# EAGLE design thedevice (EAGLE 7.2.0)

## Sheet 1 of 6: power supply
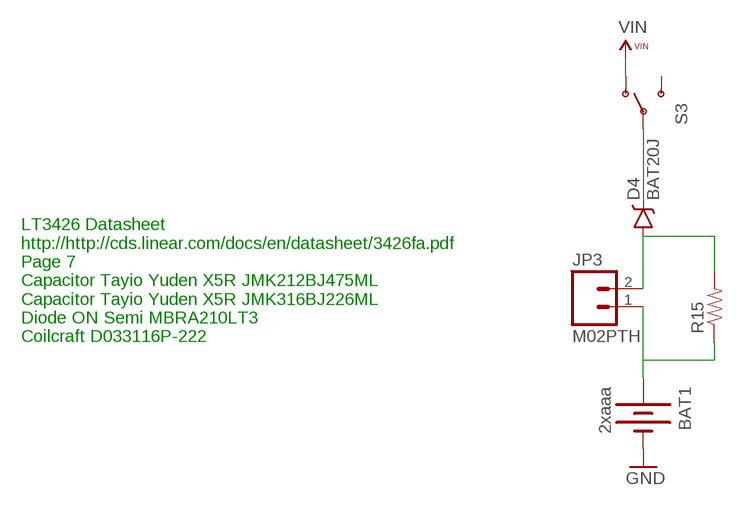
[diagram p0: schematic, sheet 1]

### Parts
BAT1  2xaaa  BATTERY  [BATTERY-2AAA-2468-PTH]
D4  BAT20J  DIODE-SCHOTTKY-BAT20J  [SOD-323]
JP3  M02PTH  [1X02]
R15  RESISTOR0603-RES  [0603-RES]
S3  SWITCH-SPDTSMD2  [SWITCH-SPDT-SMD]

### Nets
GND [power]: BAT1.- ; also sheet 2,3,4,5,6
N$3 [power]: BAT1.+ JP3.1 R15.1
N$11 [power]: D4.C S3.2(P)
N$12 [power]: D4.A JP3.2 R15.2
VIN [power]: S3.1(O) ; also sheet 3,5,6
Unconnected: S3.3(S)

### Notes on the sheet
- LT3426 Datasheet
  http://http://cds.linear.com/docs/en/datasheet/3426fa.pdf
  Page 7
  Capacitor Tayio Yuden X5R JMK212BJ475ML
  Capacitor Tayio Yuden X5R JMK316BJ226ML
  Diode ON Semi MBRA210LT3
  Coilcraft D033116P-222

## Sheet 2 of 6: Sensors
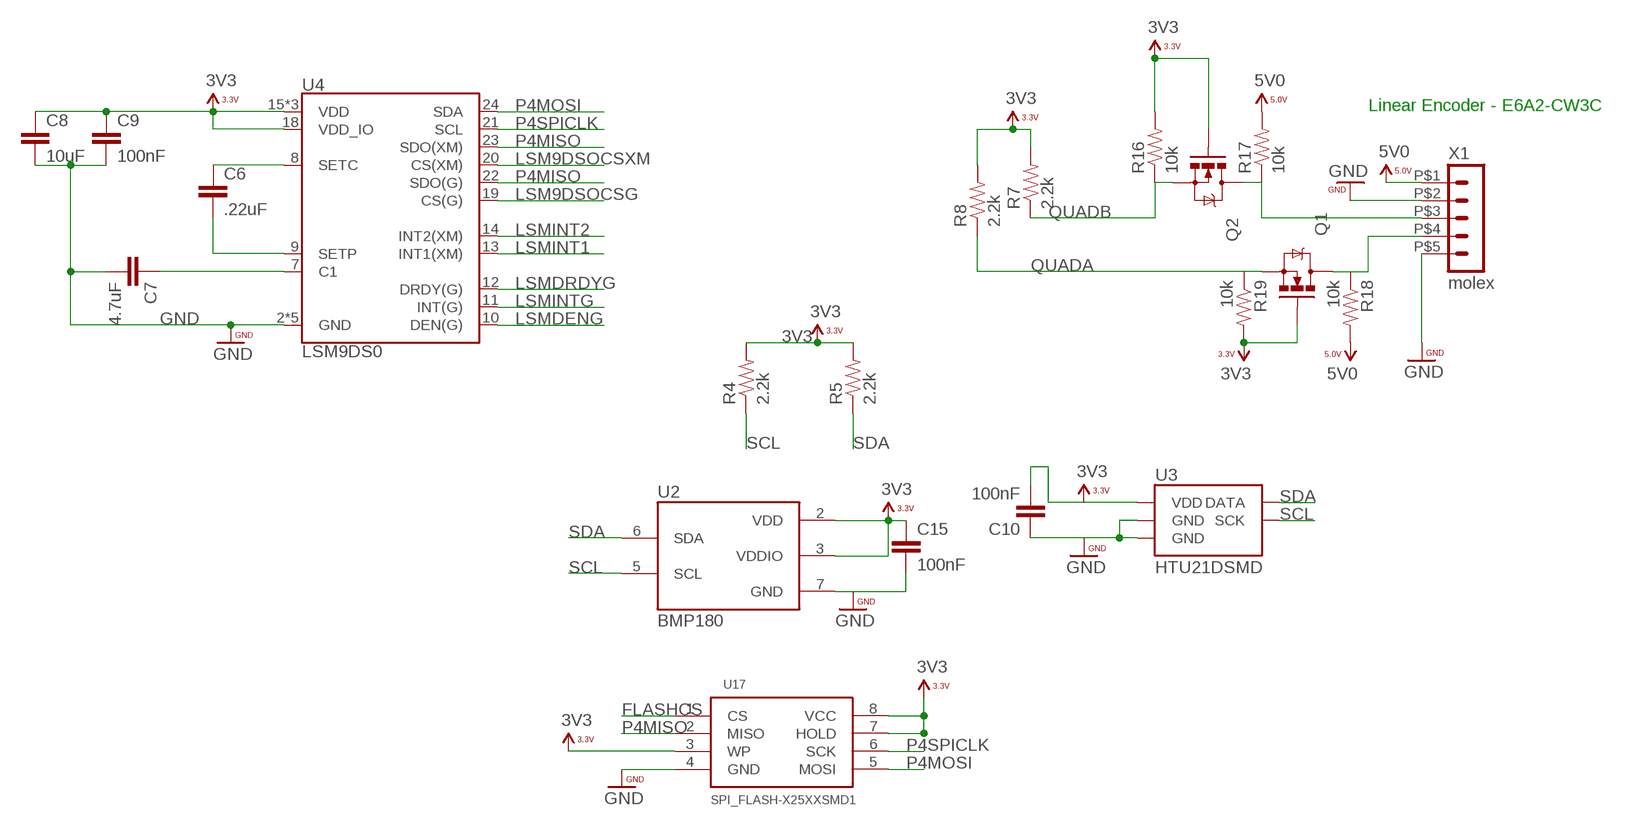
[diagram p1: schematic, sheet 2]

### Parts
C6  .22uF  CAP0603-CAP  [0603-CAP]
C7  4.7uF  CAP0603-CAP  [0603-CAP]
C8  10uF  CAP0603-CAP  [0603-CAP]
C9  100nF  CAP0603-CAP  [0603-CAP]
C10  100nF  CAP0603-CAP  [0603-CAP]
C15  100nF  CAP0603-CAP  [0603-CAP]
Q1  MOSFET-NCHANNEL2N7002PW  [SOT323]
Q2  MOSFET-NCHANNEL2N7002PW  [SOT323]
R4  2.2k  RESISTOR0603  [0603-RES]
R5  2.2k  RESISTOR0603  [0603-RES]
R7  2.2k  RESISTOR0603  [0603-RES]
R8  2.2k  RESISTOR0603  [0603-RES]
R16  10k  RESISTOR0603  [0603-RES]
R17  10k  RESISTOR0603  [0603-RES]
R18  10k  RESISTOR0603  [0603-RES]
R19  10k  RESISTOR0603  [0603-RES]
U2  BMP180  [BMP180]
U3  HTU21DSMD  [HTU21D]
U4  LSM9DS0  [LGA-24]
U17  SPI_FLASH-X25XXSMD1  [SO08-EIAJ]
X1  molex  HEADER_POS5_43650-0500  [43650-0500]

### Nets
3V3 [power]: C8.1 C9.1 C10.2 C15.1 Q1.1(G) Q2.1(G) R4.2 R5.2 R7.2 R8.2 R16.2 R19.2 U2.2(VDD) U2.3(VDDIO) U3.VDD U4.15(VDD) U4.16(VDD) U4.17(VDD) U4.18(VDD_IO) U17.3(WP) U17.7(HOLD) U17.8(VCC) ; also sheet 3,4,6
5V0 [power]: R17.2 R18.2 X1.P$1 ; also sheet 4,5
FLASHCS: U17.1(CS) ; also sheet 3
GND [power]: C7.2 C8.2 C9.2 C10.1 C15.2 U2.7(GND) U3.7(GND) U3.GND U4.2(GND) U4.3(GND) U4.4(GND) U4.5(GND) U4.6(GND) U17.4(GND) X1.P$2 X1.P$5 ; also sheet 1,3,4,5,6
LSM9DSOCSG: U4.19(CS(G)) ; also sheet 3
LSM9DSOCSXM: U4.20(CS(XM)) ; also sheet 3
LSMDENG: U4.10(DEN(G)) ; also sheet 3
LSMDRDYG: U4.12(DRDY(G)) ; also sheet 3
LSMINT1: U4.13(INT1(XM)) ; also sheet 3
LSMINT2: U4.14(INT2(XM)) ; also sheet 3
LSMINTG: U4.11(INT(G)) ; also sheet 3
N$4: C6.2 U4.9(SETP)
N$5: C7.1 U4.7(C1)
N$6: C6.1 U4.8(SETC)
N$14: Q2.3(D) R17.1 X1.P$3
N$19: Q1.3(D) R18.1 X1.P$4
P4MISO: U4.22(SDO(G)) U4.23(SDO(XM)) U17.2(MISO) ; also sheet 3
P4MOSI: U4.24(SDA) U17.5(MOSI) ; also sheet 3
P4SPICLK: U4.21(SCL) U17.6(SCK) ; also sheet 3
QUADA: Q1.2(S) R8.1 R19.1 ; also sheet 3
QUADB: Q2.2(S) R7.1 R16.1 ; also sheet 3
SCL: R4.1 U2.5(SCL) U3.SCK ; also sheet 3,4
SDA: R5.1 U2.6(SDA) U3.DATA ; also sheet 3,4

### Notes on the sheet
- Linear Encoder - E6A2-CW3C

## Sheet 3 of 6: BLE
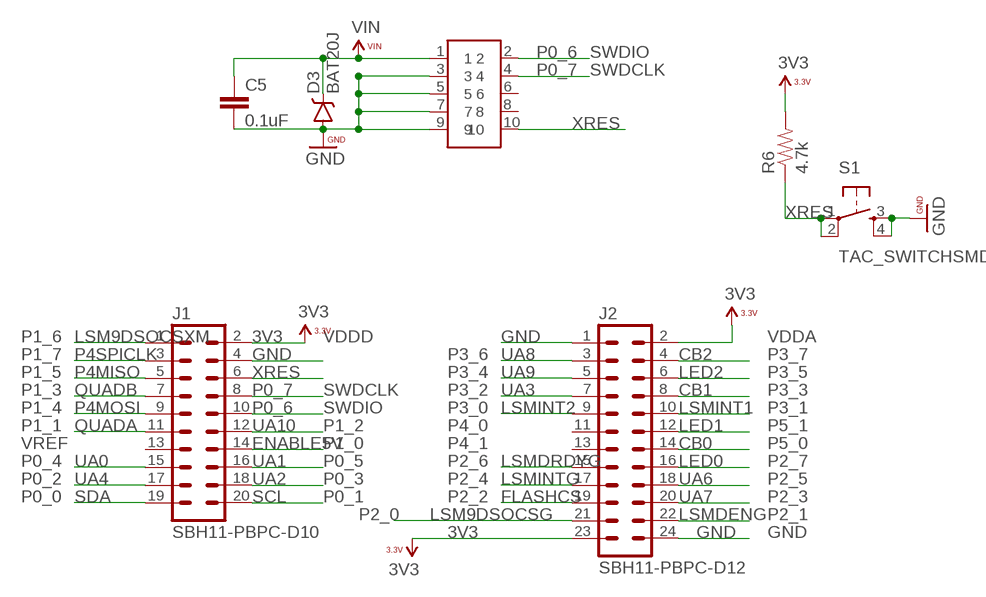
[diagram p2: schematic, sheet 3]

### Parts
C5  0.1uF  CAP0603-CAP  [0603-CAP]
D3  BAT20J  DIODE-SCHOTTKY-BAT20J  [SOD-323]
J1  SBH11-PBPC-D10  [SBH11-PBPC-D10]
J2  SBH11-PBPC-D12  [SBH11-PBPC-D12]
JP  SAMTEC  [FTSH-105-01-XXX-DV-K]
R6  4.7k  RESISTOR0603-RES  [0603-RES]
S1  TAC_SWITCHSMD  [TACTILE-SWITCH-SMD]

### Nets
3V3 [power]: J1.2 J2.2 J2.23 R6.2 ; also sheet 2,4,6
CB0: J2.14 ; also sheet 4
CB1: J2.8 ; also sheet 4
CB2: J2.4 ; also sheet 4
ENABLE5V: J1.14 ; also sheet 5
FLASHCS: J2.19 ; also sheet 2
GND [power]: C5.2 D3.A J1.4 J2.1 J2.24 JP.3 JP.5 JP.7 JP.9 S1.3 S1.4 ; also sheet 1,2,4,5,6
LED0: J2.16 ; also sheet 4
LED1: J2.12 ; also sheet 4
LED2: J2.6 ; also sheet 4
LSM9DSOCSG: J2.21 ; also sheet 2
LSM9DSOCSXM: J1.1 ; also sheet 2
LSMDENG: J2.22 ; also sheet 2
LSMDRDYG: J2.15 ; also sheet 2
LSMINT1: J2.10 ; also sheet 2
LSMINT2: J2.9 ; also sheet 2
LSMINTG: J2.17 ; also sheet 2
P0_6: J1.10 JP.2
P0_7: J1.8 JP.4
P4MISO: J1.5 ; also sheet 2
P4MOSI: J1.9 ; also sheet 2
P4SPICLK: J1.3 ; also sheet 2
QUADA: J1.11 ; also sheet 2
QUADB: J1.7 ; also sheet 2
SCL: J1.20 ; also sheet 2,4
SDA: J1.19 ; also sheet 2,4
UA0: J1.15 ; also sheet 4
UA1: J1.16 ; also sheet 4
UA2: J1.18 ; also sheet 4
UA3: J2.7 ; also sheet 4
UA4: J1.17 ; also sheet 4
UA6: J2.18 ; also sheet 4
UA7: J2.20 ; also sheet 4
UA8: J2.3 ; also sheet 4
UA9: J2.5 ; also sheet 4
UA10: J1.12 ; also sheet 4
VIN [power]: C5.1 D3.C JP.1 ; also sheet 1,5,6
XRES: J1.6 JP.10 R6.1 S1.1 S1.2
Unconnected: J1.13 J2.11 J2.13 JP.6 JP.8

### Notes on the sheet
- SWDIO
- SWDCLK
- P1_6 | VDDD | VDDA
- P1_7 | P3_6 | P3_7
- P1_5 | P3_4 | P3_5
- P1_3 | SWDCLK | P3_2 | P3_3
- P1_4 | SWDIO | P3_0 | P3_1
- P1_1 | P1_2 | P4_0 | P5_1
- VREF | P1_0 | P4_1 | P5_0
- P0_4 | P0_5 | P2_6 | P2_7
- P0_2 | P0_3 | P2_4 | P2_5
- P0_0 | P0_1 | P2_2 | P2_3
- P2_0 | P2_1
- GND

## Sheet 4 of 6: GUI
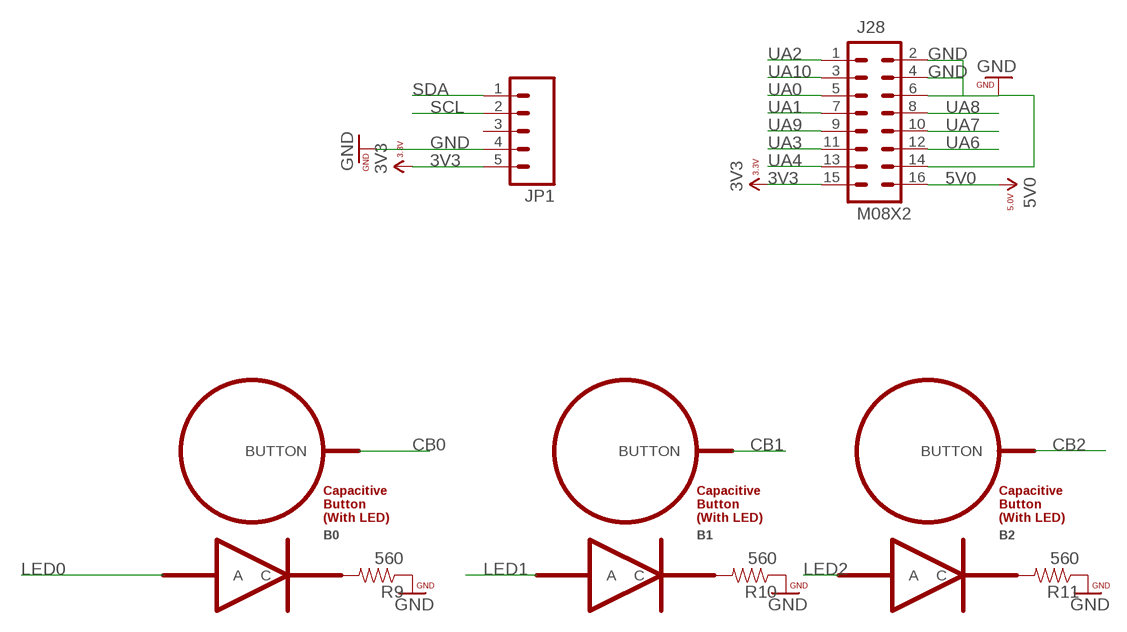
[diagram p3: schematic, sheet 4]

### Parts
B0  BUTTON_PASSIVE_LED  [BUTTON_PASSIVE_12MM_LED]
B1  BUTTON_PASSIVE_LED  [BUTTON_PASSIVE_12MM_LED]
B2  BUTTON_PASSIVE_LED  [BUTTON_PASSIVE_12MM_LED]
J28  M08X2  [2X8]
JP1  M05NO_SILK  [1X05_NO_SILK]
R9  560  RESISTOR0603-RES  [0603-RES]
R10  560  RESISTOR0603-RES  [0603-RES]
R11  560  RESISTOR0603-RES  [0603-RES]

### Nets
3V3 [power]: J28.15 JP1.5 ; also sheet 2,3,6
5V0 [power]: J28.16 ; also sheet 2,5
CB0: B0.BUTTON ; also sheet 3
CB1: B1.BUTTON ; also sheet 3
CB2: B2.BUTTON ; also sheet 3
GND [power]: J28.2 J28.4 J28.6 J28.14 JP1.4 R9.1 R10.1 R11.1 ; also sheet 1,2,3,5,6
LED0: B0.A ; also sheet 3
LED1: B1.A ; also sheet 3
LED2: B2.A ; also sheet 3
N$8: B0.C R9.2
N$9: B1.C R10.2
N$10: B2.C R11.2
SCL: JP1.2 ; also sheet 2,3
SDA: JP1.1 ; also sheet 2,3
UA0: J28.5 ; also sheet 3
UA1: J28.7 ; also sheet 3
UA2: J28.1 ; also sheet 3
UA3: J28.11 ; also sheet 3
UA4: J28.13 ; also sheet 3
UA6: J28.12 ; also sheet 3
UA7: J28.10 ; also sheet 3
UA8: J28.8 ; also sheet 3
UA9: J28.9 ; also sheet 3
UA10: J28.3 ; also sheet 3
Unconnected: JP1.3

## Sheet 5 of 6: 5.0V Power
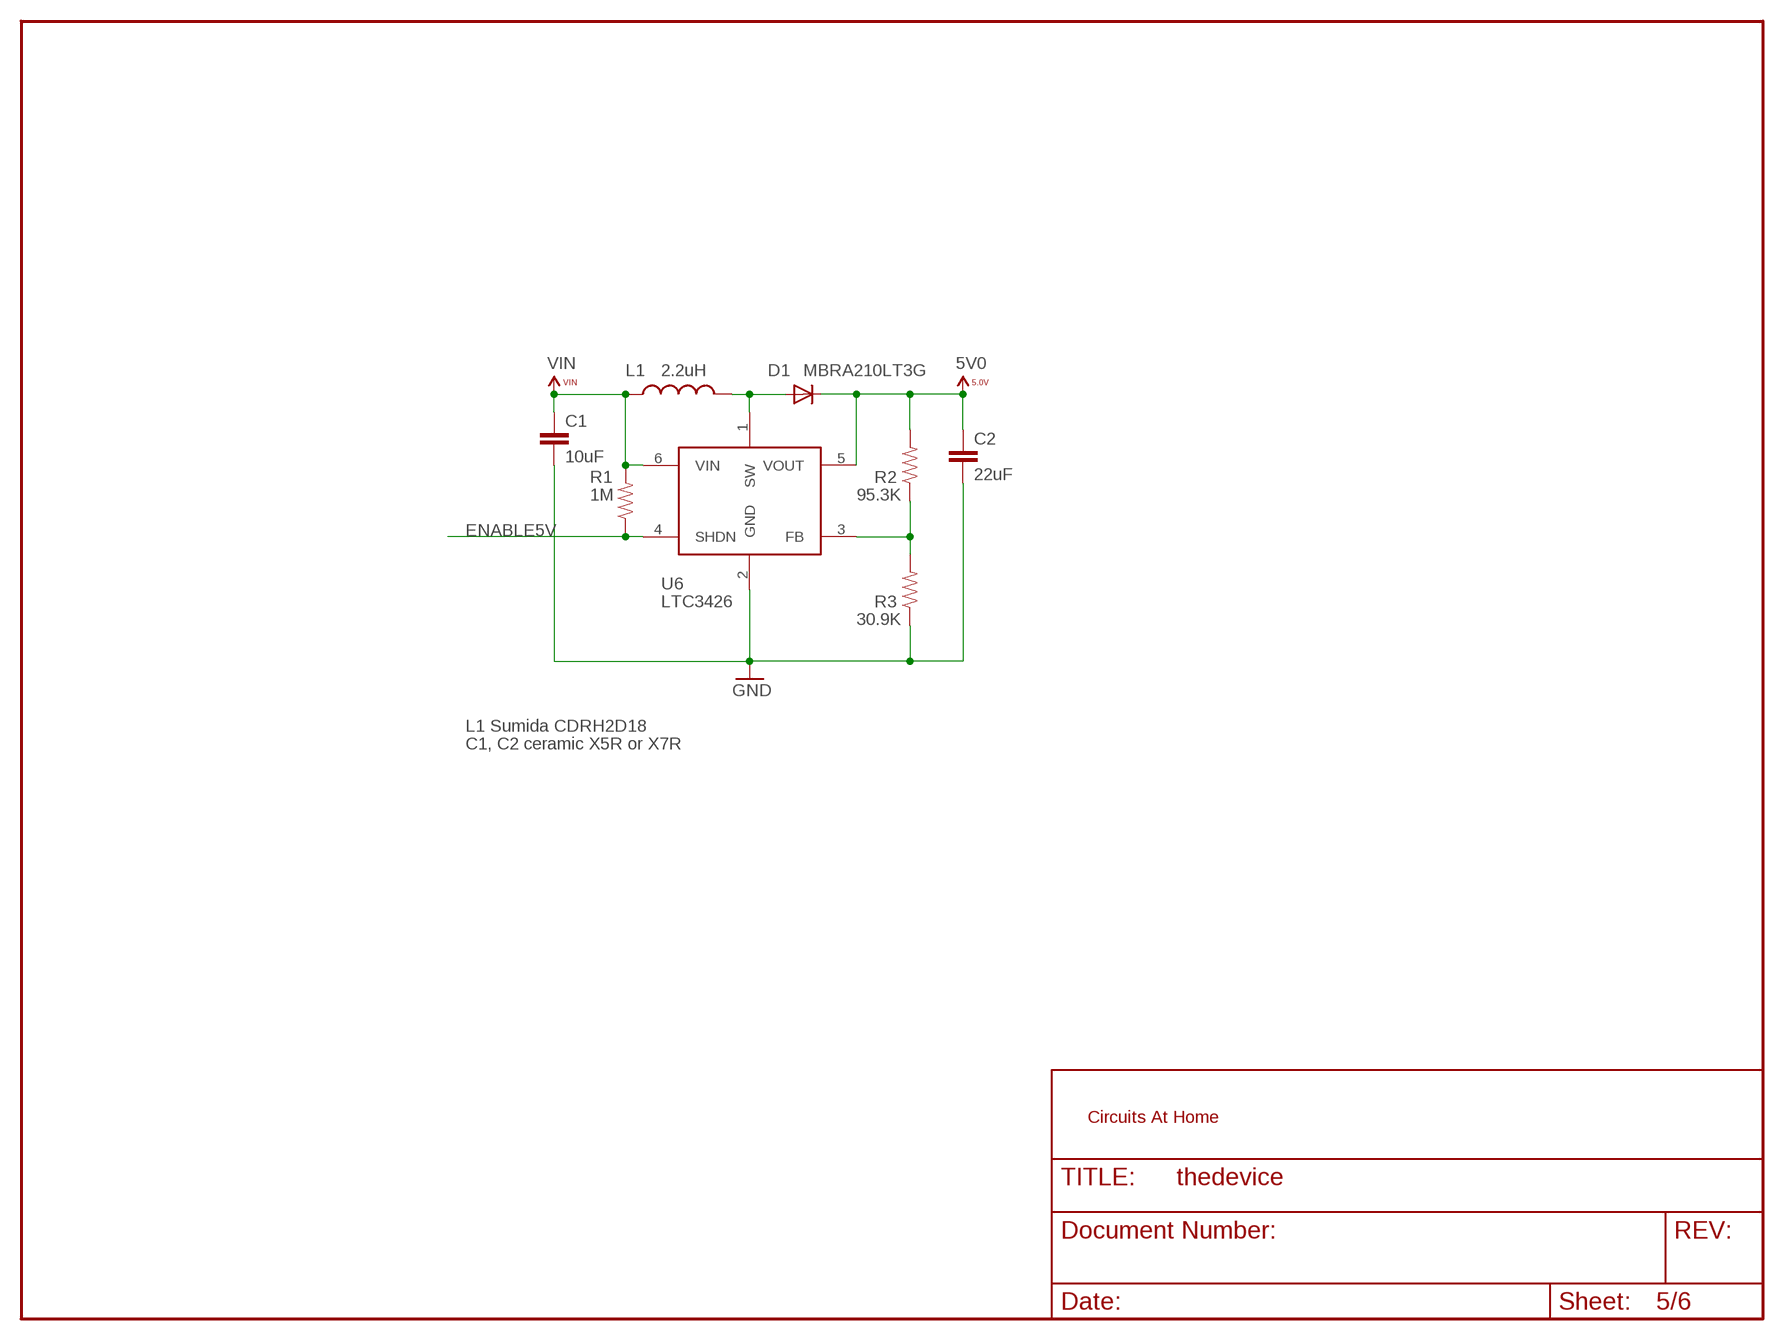
[diagram p4: schematic, sheet 5]

### Parts
C1  10uF  CAP0603-CAP  [0603-CAP]
C2  22uF  CAP0603-CAP  [0603-CAP]
D1  MBRA210LT3G  DIODESMA  [SMA-DIODE]
L1  2.2uH  INDUCTOR1313  [1_3X1_3]
R1  1M  RESISTOR0603  [0603]
R2  95.3K  RESISTOR0603  [0603]
R3  30.9K  RESISTOR0603  [0603]
U6  LTC3426  [SOT23-6]

### Nets
5V0 [power]: C2.1 D1.C R2.2 U6.5(VOUT) ; also sheet 2,4
ENABLE5V: R1.1 U6.4(SHDN) ; also sheet 3
FB5: R2.1 R3.2 U6.3(FB)
GND [power]: C1.2 C2.2 R3.1 U6.2(GND) ; also sheet 1,2,3,4,6
SW5: D1.A L1.P$2 U6.1(SW)
VIN [power]: C1.1 L1.P$1 R1.2 U6.6(VIN) ; also sheet 1,3,6

### Notes on the sheet
- L1 Sumida CDRH2D18
- C1, C2 ceramic X5R or X7R

## Sheet 6 of 6: 3.3V Power
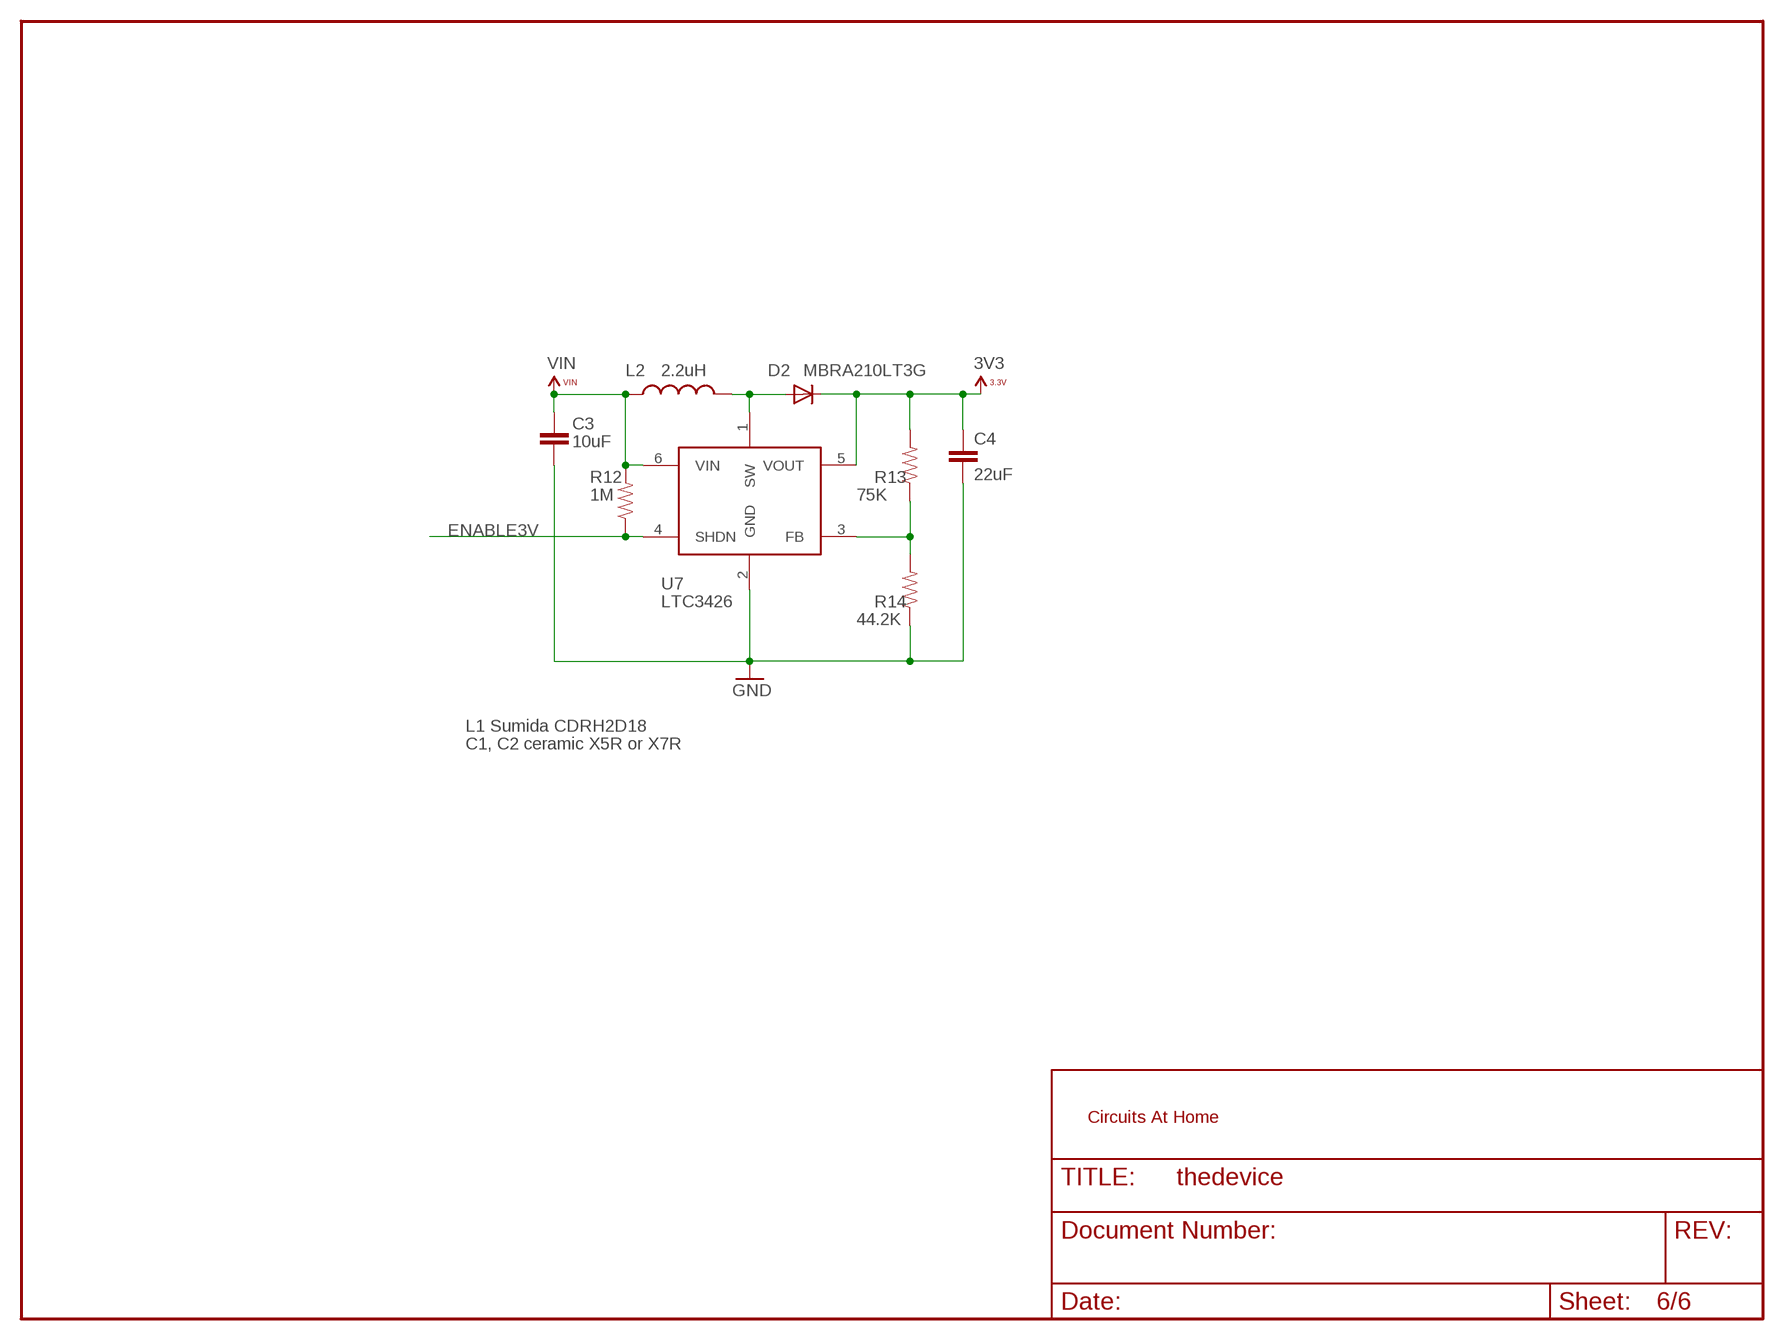
[diagram p5: schematic, sheet 6]

### Parts
C3  10uF  CAP0603  [0603]
C4  22uF  CAP0603-CAP  [0603-CAP]
D2  MBRA210LT3G  DIODESMA  [SMA-DIODE]
L2  2.2uH  INDUCTOR1313  [1_3X1_3]
R12  1M  RESISTOR0603  [0603]
R13  75K  RESISTOR0603  [0603]
R14  44.2K  RESISTOR0603  [0603]
U7  LTC3426  [SOT23-6]

### Nets
3V3 [power]: C4.1 D2.C R13.2 U7.5(VOUT) ; also sheet 2,3,4
ENABLE3V: R12.1 U7.4(SHDN)
FB3: R13.1 R14.2 U7.3(FB)
GND [power]: C3.2 C4.2 R14.1 U7.2(GND) ; also sheet 1,2,3,4,5
SW3: D2.A L2.P$2 U7.1(SW)
VIN [power]: C3.1 L2.P$1 R12.2 U7.6(VIN) ; also sheet 1,3,5

### Notes on the sheet
- L1 Sumida CDRH2D18
- C1, C2 ceramic X5R or X7R

## Library data of the parts
B0 B1 B2 = PatternAgents-TouchWidgets:BUTTON_PASSIVE_LED: Button, Passive Touch/Capacitive Sensing Type, with LED & Hole Source : http://www.PatternAgents.com Github : https://github.com/PatternAgents License : http://creativecommons.org/licenses/by-sa/3.1/ (Creative Commons 3.1) THIS SOFTWARE IS PROVIDED BY THE CONTRIBUTORS "AS IS" AND WITHOUT ANY EXPRESS OR IMPLIED WARRANTIES, INCLUDING, BUT NOT LIMITED TO, THE IMPLIED WARRANTIES OF MERCHANTABILITY AND FITNESS FOR A PARTICULAR PURPOSE ARE DISCLAIMED. IN NO EVENT SHALL THE COPYRIGHT OWNER OR CONTRIBUTORS BE LIABLE FOR ANY DIRECT, INDIRECT, INCIDENTAL, SPECIAL, EXEMPLARY, OR CONSEQUENTIAL DAMAGES (INCLUDING, BUT NOT LIMITED TO, PROCUREMENT OF SUBSTITUTE GOODS OR SERVICES; LOSS OF USE, DATA, OR PROFITS; OR BUSINESS INTERRUPTION) HOWEVER CAUSED AND ON ANY THEORY OF LIABILITY, WHETHER IN CONTRACT, STRICT LIABILITY, OR TORT (INCLUDING NEGLIGENCE OR OTHERWISE) ARISING IN ANY WAY OUT OF THE USE OF THIS SOFTWARE, EVEN IF ADVISED OF THE POSSIBILITY OF SUCH DAMAGE.; PARTNO: SML-LX1206IC-TR
BAT1 = SparkFun-Electromechanical:BATTERY: Battery Holders Various common sizes : AA, AAA, 20mm coin cell and 12mm coin cell. 20MM_4LEGS, BATT-10373; PARTNO: 2468
C1 C8 = SparkFun-Capacitors:CAP: Capacitor Standard 0603 ceramic capacitor, and 0.1" leaded capacitor.; PARTNO: GRM188R60J106ME47D
C2 C4 = SparkFun-Capacitors:CAP: Capacitor Standard 0603 ceramic capacitor, and 0.1" leaded capacitor.; PARTNO: GRM188R60G226MEA0D
C3 = CH_passive:CAP: Capacitor Standard 0603 ceramic capacitor, and 0.1" leaded capacitor.; PARTNO: GRM188R60J106ME47D
C5 C9 C10 C15 = SparkFun-Capacitors:CAP: Capacitor Standard 0603 ceramic capacitor, and 0.1" leaded capacitor.; PARTNO: GRM188R61E104KA01D
C6 = SparkFun-Capacitors:CAP: Capacitor Standard 0603 ceramic capacitor, and 0.1" leaded capacitor.; PARTNO: GRM188R61A224KA01D
C7 = SparkFun-Capacitors:CAP: Capacitor Standard 0603 ceramic capacitor, and 0.1" leaded capacitor.; PARTNO: GRM188R60J475KE19D
D1 D2 = CH_semiconductors:DIODE: Diode These are standard reverse protection diodes and small signal diodes. SMA package can handle up to about 1A. SOD-323 can handle about 200mA. What the SOD-323 package when ordering, there are some mfgs out there that are 5-pin packages.; PARTNO: MBRA210LT3G
D3 D4 = SparkFun-DiscreteSemi:DIODE-SCHOTTKY: Schottky diodes in SFE's production catalog BAT20J 1A 23V 0.62Vf RB751 120mA 40V 0.37Vf PMEG4005EJ 0.5A 40V 0.42Vf MBRA140 1A 40V 0.5Vf B340A 3A 40V SMA; PARTNO: NSR0320MW2T1G; PROD_ID: DIO-11623
J1 = con-sullins:SBH11-PBPC-D10: HEADER - Vertical, Shrouded; PARTNO: SBH11-PBPC-D10-ST-BK
J2 = con-sullins:SBH11-PBPC-D12: HEADER - Vertical, Shrouded; PARTNO: SBH11-PBPC-D12-RA-BK
J28 = SparkFun-Connectors:M08X2: .1" headers, two rows of 8 each
JP = arh:SAMTEC; PARTNO: FTSH-105-01-F-DV-K
JP1 = SparkFun-Connectors:M05: Header 5 Standard 5-pin 0.1" header. Use with straight break away headers (SKU : PRT-00116), right angle break away headers (PRT-00553), swiss pins (PRT-00743), machine pins (PRT-00117), and female headers (PRT-00115). Molex polarized connector foot print use with SKU : PRT-08230 with associated crimp pins and housings.
JP3 = SparkFun-Connectors:M02: Standard 2-pin 0.1" header. Use with - straight break away headers ( PRT-00116) - right angle break away headers (PRT-00553) - swiss pins (PRT-00743) - machine pins (PRT-00117) - female headers (PRT-00115) Molex polarized connector foot print use with: PRT-08233 with associated crimp pins and housings. 2.54_SCREWTERM for use with PRT-10571. 3.5mm Screw Terminal footprints for PRT-08084 5mm Screw Terminal footprints for use with PRT-08432
L1 L2 = CH_passive:INDUCTOR: Inductors Basic Inductor/Choke - 0603 and 1206. Footprints are not proven and vary greatly between part numbers.; PARTNO: CDRH2D09NP-2R2MC
Q1 Q2 = SparkFun-DiscreteSemi:MOSFET-NCHANNEL: Common NMOSFET Parts MFG P/N Store ID Prod ID FDD8780 TRANS-09984 SI7820DN TRANS-11055 FDS6630A IC-08089 2N7002PW TRANS-11151 FQP30N06L COM-10213 TRANS-10060 BSS123LT1G TRANS-08345 BSS138 TRANS-00830 BS170 2N7000; PROD_ID: TRANS-11151
R1 R12 = CH_passive:RESISTOR: Resistor; PARTNO: ERJ-3GEYJ105V
R2 = CH_passive:RESISTOR: Resistor; PARTNO: ERJ-3EKF9532V
R3 = CH_passive:RESISTOR: Resistor; PARTNO: ERJ-3EKF3092V
R4 R5 R7 R8 R16-R19 = SparkFun-Resistors:RESISTOR: Resistor; PARTNO: MCR03ERTJ222
R6 = SparkFun-Passives:RESISTOR: Resistor; PARTNO: ERJ-3GEYJ472V
R9-R11 = SparkFun-Passives:RESISTOR: Resistor; PARTNO: ERJ-3GEYJ561V
R13 = CH_passive:RESISTOR: Resistor; PARTNO: ERJ-3EKF7502V
R14 = CH_passive:RESISTOR: Resistor; PARTNO: ERJ-3EKF4422V
R15 = SparkFun-Passives:RESISTOR: Resistor
S1 = SparkFun-Electromechanical:TAC_SWITCH: Momentary Switch Button commonly used for reset or general input. Spark Fun Electronics SKU : COM-00097 SMT- SWCH-08247; PARTNO: PTS525SM10SMTR LFS; PROD_ID: SWCH-08247
S3 = SparkFun-Electromechanical:SWITCH-SPDT: SPDT Switch Simple slide switch, Spark Fun Electronics SKU : COM-00102 DPDT SMT slide switch, AYZ0202, SWCH-08179
U2 = SparkFun-Sensors:BMP180: BOSCH BMP180 DIGITAL BAROMETRIC PRESSURE SENSOR Web page: http://www.bosch-sensortec.com/en/homepage/products_3/environmental_sensors_1/bmp180_1/bmp180 Datasheet: http://ae-bst.resource.bosch.com/media/products/dokumente/bmp180/BST-BMP180-DS000-09.pdf The BMP180 is the function compatible successor of the BMP085, a new generation of high precision digital pressure sensors for consumer applications. The ultra-low power, low voltage electronics of the BMP180 is optimized for use in mobile phones, PDAs, GPS navigation devices and outdoor equipment. With a low altitude noise of merely 0.25m at fast conversion time, the BMP180 offers superior performance. The I2C interface allows for easy system integration with a microcontroller. The BMP180 is based on piezo-resistive technology for EMC robustness, high accuracy and linearity as well as long term stability. Key features: - Temperature measurement included - I2C interface - Fully calibrated - Pb-free, halogen-free and RoHS compliant, - MSL 1 Basic specs: Pressure range: 300 to 1100hPa (+9000m to -500m relating to sea level) Supply voltage: 1.8 to 3.6V (VDD), 1.62V to 3.6V (VDDIO) Package: LGA package with metal lid Small footprint: 3.6mm x 3.8mm Super-flat: 0.93mm height Low power: 5μA at 1 sample / sec. in standard mode Low noise: 0.06hPa (0.5m) in ultra low power mode, 0.02hPa (0.17m) advanced resolution mode Typical applications: - Enhancement of GPS navigation (dead-reckoning, slope detection, etc.) - In- and out-door navigation - Leisure and sports - Weather forecast - Vertical velocity indication (rise/sink speed); PARTNO: BMP180
U3 = SparkFun-Sensors:HTU21D
U4 = SparkFun-DigitalIC:LSM9DS0: LSM9DS0 3D Accelerometer, 3D Gyroscope, 3D Magnetomter Features: 3 acceleration channels, 3 angular rate channels, 3 magnetic field channels ±2/±4/±6/±8/±16 g linear acceleration full scale ±2/±4/±8/±12 gauss magnetic full scale ±245/±500/±2000 dps angular rate full scale 16-bit data output SPI / I2C serial interfaces Analog supply voltage 2.4 V to 3.6 V Power-down mode / low-power mode Programmable interrupt generators Embedded self-test Embedded temperature sensor Embedded FIFO Position and motion detection functions Click/double-click recognition
U6 U7 = CH_Linear_technology:LTC3426; PARTNO: LTC3426ES6#TRMPBF
U17 = SparkFun-DigitalIC:SPI_FLASH-X25XX: 8pin SPI Flash series x25xx. Works with devices like W25X32 and BR25L32
X1 = con-molex-micro-fit-3_0:HEADER_POS5_?: Molex - Micro-Fit 3.0 Series connector, 3.00mm (0.118") pitch header, 5 positions.; PARTNO: 0436500500

## Net classes
0 default: width 0.203 mm, clearance 0.205 mm
1 power: width 1.016 mm, clearance 0.205 mm to class 0, clearance 0.205 mm

## Board
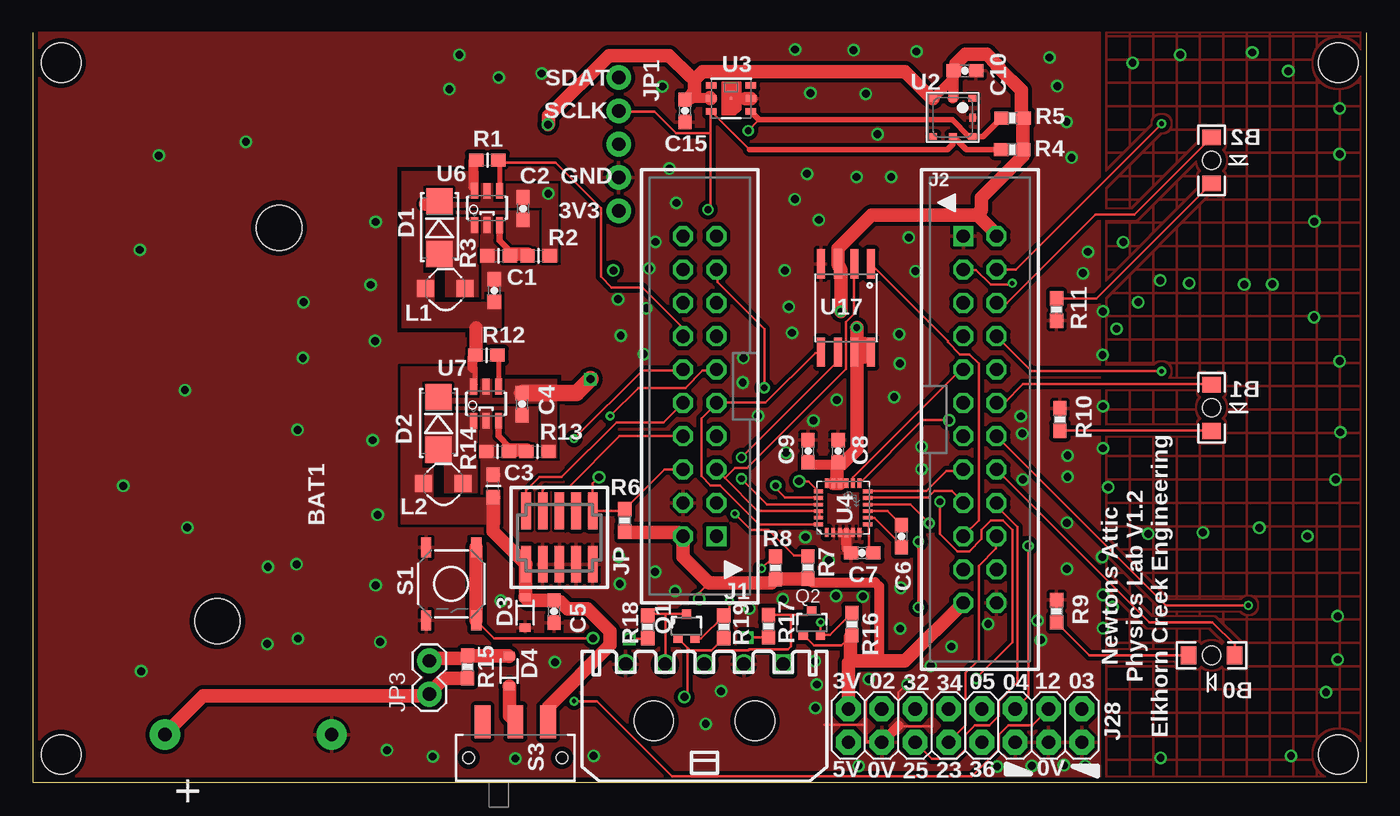
[diagram p6: board, top side]
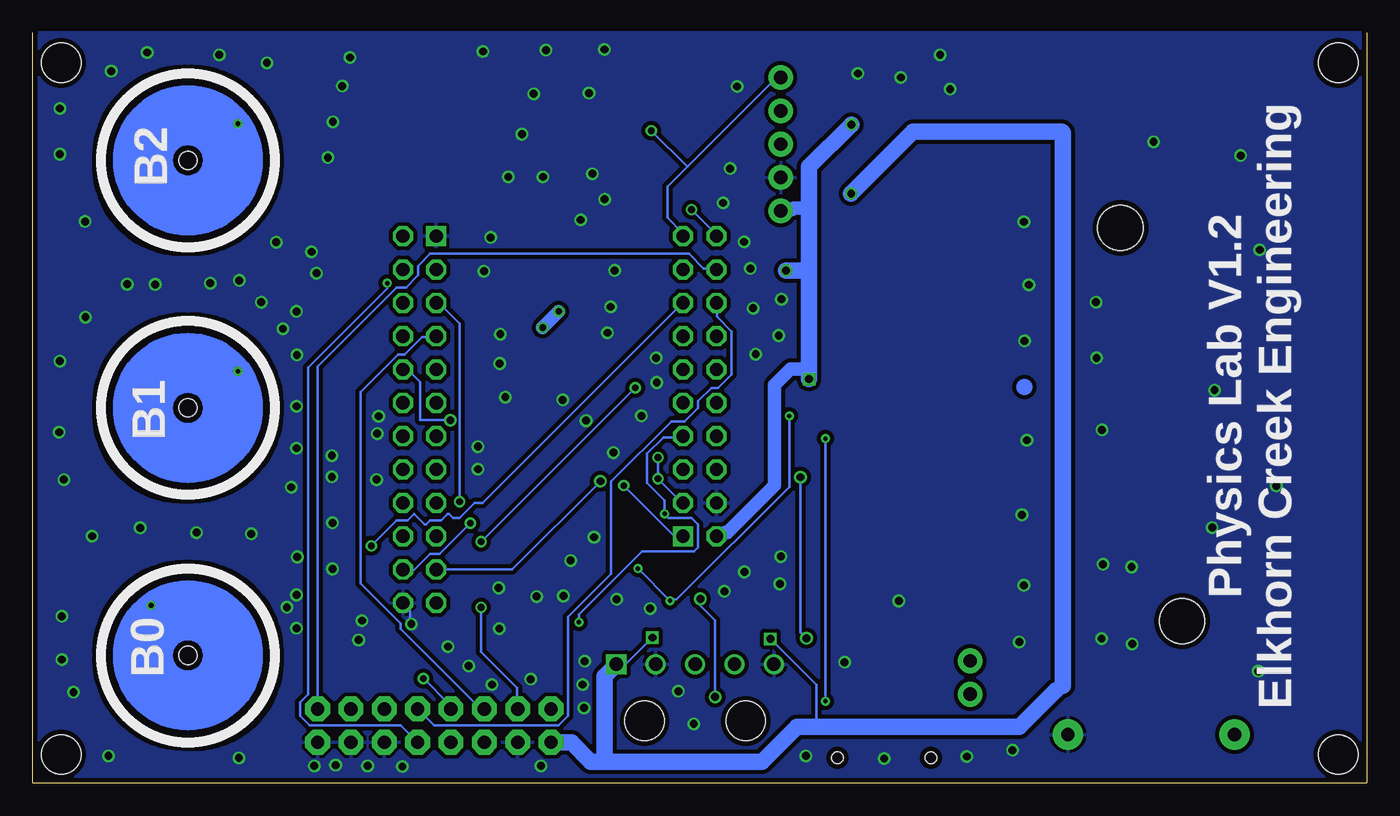
[diagram p7: board, bottom side, seen from below]

Size 101.6 x 57.15 mm. Coordinates in mm from the lower left corner, seen from the top.
Outline: 101.6,57.15 101.6,0 0,0 0,57.15
Copper layers (1*16): Top 0.0356mm / dielectric 1.5011mm / Bottom 0.0356mm
Design rules "LaenPCBOrder *": minimum track width 6mil, minimum drill 13mil, track to track 6mil, track to pad 6mil, pad to pad 6mil, via to via 6mil, smd to smd 6mil, copper to edge 15mil, drill to drill 6mil, minimum pad ring 7mil, minimum via ring 7mil, stop-mask expansion 3mil, vias tented up to drill 24mil, thermal gap 10mil
Holes 3 mm at 2.16,2.16 2.16,54.86 99.44,2.16 99.44,54.86
tKeepout: area 81.6,-2.8 to 102.8,58.8
bKeepout: area 81.7,-3.2 to 104.4,59.2

### Footprints (pad centres in the part's own frame; a part is rotated, then mirrored left to right if it is on the bottom)
BUTTON_PASSIVE_12MM_LED = smd 1.2 x 1.4 bottom: A -1.754,0; C 1.754,0 | drill 0.356: BUTTON -2.794,3.81 | hole 1.4: 0,0
BATTERY-2AAA-2468-PTH = drill 1.016 pad 2.3: + 50.114,5.944; - 50.114,18.644 | hole 3.454: 11.506,14.643; 41.478,9.944
0603-CAP = smd 1.1 x 1: 1 -0.85,0; 2 0.85,0
0603 = smd 1.1 x 1: 1 -0.85,0; 2 0.85,0
SMA-DIODE = smd 2 x 2: A -2,0; C 2,0
SOD-323 = smd 0.63 x 0.83: A 1.15,0; C -1.15,0
SBH11-PBPC-D10 = drill 1.016 square: 1 -11.43,-1.27 | drill 1.016 octagon: 2 -11.43,1.27; 3 -8.89,-1.27; 4 -8.89,1.27; 5 -6.35,-1.27; 6 -6.35,1.27; 7 -3.81,-1.27; 8 -3.81,1.27; 9 -1.27,-1.27; 10 -1.27,1.27; 11 1.27,-1.27; 12 1.27,1.27; 13 3.81,-1.27; 14 3.81,1.27; 15 6.35,-1.27; 16 6.35,1.27; 17 8.89,-1.27; 18 8.89,1.27; 19 11.43,-1.27; 20 11.43,1.27
SBH11-PBPC-D12 = drill 1.016 square: 1 -13.97,-1.27 | drill 1.016 octagon: 2 -13.97,1.27; 3 -11.43,-1.27; 4 -11.43,1.27; 5 -8.89,-1.27; 6 -8.89,1.27; 7 -6.35,-1.27; 8 -6.35,1.27; 9 -3.81,-1.27; 10 -3.81,1.27; 11 -1.27,-1.27; 12 -1.27,1.27; 13 1.27,-1.27; 14 1.27,1.27; 15 3.81,-1.27; 16 3.81,1.27; 17 6.35,-1.27; 18 6.35,1.27; 19 8.89,-1.27; 20 8.89,1.27; 21 11.43,-1.27; 22 11.43,1.27; 23 13.97,-1.27; 24 13.97,1.27
2X8 = drill 1.016 pad 1.88 octagon: 1 0,0; 2 0,2.54; 3 2.54,0; 4 2.54,2.54; 5 5.08,0; 6 5.08,2.54; 7 7.62,0; 8 7.62,2.54; 9 10.16,0; 10 10.16,2.54; 11 12.7,0; 12 12.7,2.54; 13 15.24,0; 14 15.24,2.54; 15 17.78,0; 16 17.78,2.54
FTSH-105-01-XXX-DV-K = smd 0.737 x 2.794: 1 -2.54,-2.032; 2 -2.54,2.032; 3 -1.27,-2.032; 4 -1.27,2.032; 5 0,-2.032; 6 0,2.032; 7 1.27,-2.032; 8 1.27,2.032; 9 2.54,-2.032; 10 2.54,2.032
1X05_NO_SILK = drill 1.016 pad 1.88: 1 0,0; 2 2.54,0; 3 5.08,0; 4 7.62,0; 5 10.16,0
1X02 = drill 1.016 pad 1.88: 1 0,0; 2 2.54,0
1_3X1_3 = smd 1.3 x 1.3: P$1 -1.5,0; P$2 1.5,0
SOT323 = smd 0.7 x 0.7: 1 -0.65,-0.925; 2 0.65,-0.925; 3 0,0.925
0603-RES = smd 1.1 x 1: 1 -0.85,0; 2 0.85,0
TACTILE-SWITCH-SMD = smd 1.524 x 0.762: 1 -2.794,1.905; 2 2.794,1.905; 3 -2.794,-1.905; 4 2.794,-1.905
SWITCH-SPDT-SMD = smd 1.2 x 2.5: 1 -2.5,-2.75; 2 0,-2.75; 3 2.5,-2.75 | hole 0.9: -3.55,0; 3.55,0
BMP180 = smd 0.6 x 0.5: 1 1.5,1.45; 2 0,1.45; 3 -1.5,1.45; 4 -1.5,-1.45; 5 0,-1.45; 6 1.5,-1.45 | smd 0.5 x 0.6: 7 1.5,0
HTU21D = smd 0.2 x 0.2: 7 0,0 | smd 0.8 x 0.5: DATA 1.5,-1; GND 1.5,0; NC@1 -1.5,1; NC@6 1.5,1; SCK -1.5,-1; VDD -1.5,0
LGA-24 = smd 0.7 x 0.29: 1 -1.875,1.25; 2 -1.875,0.75; 3 -1.875,0.25; 4 -1.875,-0.25; 5 -1.875,-0.75; 6 -1.875,-1.25; 13 1.875,-1.25; 14 1.875,-0.75; 15 1.875,-0.25; 16 1.875,0.25; 17 1.875,0.75; 18 1.875,1.25 | smd 0.29 x 0.7: 7 -1.25,-1.875; 8 -0.75,-1.875; 9 -0.25,-1.875; 10 0.25,-1.875; 11 0.75,-1.875; 12 1.25,-1.875; 19 1.25,1.875; 20 0.75,1.875; 21 0.25,1.875; 22 -0.25,1.875; 23 -0.75,1.875; 24 -1.25,1.875
SOT23-6 = smd 0.55 x 1.2: 1 -0.95,-1.3; 2 0,-1.3; 3 0.95,-1.3; 4 0.95,1.3; 5 0,1.3; 6 -0.95,1.3
SO08-EIAJ = smd 0.61 x 2.21: 1 -1.905,-3.378; 2 -0.635,-3.378; 3 0.635,-3.378; 4 1.905,-3.378; 5 1.905,3.353; 6 0.635,3.353; 7 -0.635,3.353; 8 -1.905,3.353
43650-0500 = drill 1.02 square: P$1 6,4.32 | drill 1.02: P$2 3,4.32; P$3 0,4.32; P$4 -3,4.32; P$5 -6,4.32 | hole 3: 3.85,0; -3.85,0

### Placement (x,y rotation side)
B0  89.79,9.72 0 bottom
B1  89.79,28.57 270 bottom
B2  89.79,47.43 270 bottom
BAT1  4.11,53.8 270 top
C1  35.15,37.52 90 top
C2  37.34,43.76 270 top
C3  35.06,22.62 90 top
C4  37.26,28.85 270 top
C5  39.7,13.06 270 top
C6  66.17,18.8 90 top
C7  63.17,17.53 180 top
C8  61.34,25.27 90 top
C9  59.05,25.27 90 top
C10  70.99,54.25 180 top
C15  49.68,51.21 270 top
D1  30.98,42.3 90 top
D2  30.91,27.39 90 top
D3  37.49,12.98 270 top
D4  36.27,8.51 90 top
J1  50.8,30.23 90 top
J2  72.14,27.69 270 top
J28  79.91,5.64 180 top
JP  40.11,18.69 0 top
JP1  44.63,53.75 270 top
JP3  30.2,6.76 90 top
L1  31.43,37.65 0 top
L2  31.28,22.82 0 top
Q1  49.78,11.94 0 top
Q2  59.33,12.19 0 top
R1  34.62,47.45 180 top
R2  38.53,40.16 0 top
R3  35.48,40.16 0 top
R4  74.6,48.26 0 top
R5  74.63,50.65 0 top
R6  45.09,19.99 270 top
R7  59.03,16.41 270 top
R8  56.57,16.38 270 top
R9  77.98,13.08 270 top
R10  78.23,27.69 270 top
R11  77.98,36.07 90 top
R12  34.54,32.59 180 top
R13  38.43,25.25 0 top
R14  35.41,25.25 0 top
R15  33.12,8.84 90 top
R16  62.38,12.09 270 top
R17  56.03,11.94 270 top
R18  46.84,11.89 270 top
R19  52.63,11.89 270 top
S1  31.88,15.16 270 top
S3  36.75,1.91 180 top
U2  70.08,50.7 0 top
U3  53.19,52.15 0 top
U4  61.72,20.95 90 top
U6  34.59,43.8 0 top
U7  34.52,28.89 0 top
U17  61.95,36.17 180 top
X1  51.16,4.72 0 top

### Tracks (layer width: path | path; a pad name or v marks a point on that pad's centre or on a via)
3V3  (via drill 0.51, 0.6)
  Top 0.203: 51.64,52.15 U3.VDD | C9.1 59.18,24.3 59.18,24.26 | C8.1 61.34,24.38 61.21,24.26 61.27,24.21 61.27,24 | U4.18 U4.17 | 61.27,22.84 61.27,22.83 U4.16 U4.15 | 62.28,11.14 61.61,10.46 59.49,10.46 Q2.1 | Q1.1 49.86,10.29 | 49.86,10.29 50.04,10.11 51.7,10.11 R19.2 | 51.51,15.24 50.75,14.48 v50.75,14.02 | v49.63,6.55 49.86,6.78 49.86,10.29
  Top 0.406: 62.76,33.27 62.59,33.27 U17.7 | U17.7 63.35,32.82 63.35,32.31 63.37,32.31 | U17.8 63.37,32.82 | 62.76,32.66 62.59,32.66 U17.7
  Top 0.762: 49.84,52.05 49.99,52.2 50.11,52.2 51.56,52.2 | 70.13,54.23 70.13,52.2 U2.2 70.14,52.21 C10.2 70.14,53.71 U2.3 | 59.18,24.26 61.21,24.26 | 63.37,33.6 63.37,32.82 63.37,32.31 | R7.2 59.3,15.29 64.16,15.29 64.47,14.99 64.47,9.3
  Top 1.016: U4.17 61.03,22.86 61.43,22.86 U4.16 | 51.64,52.15 51.56,52.2 | 50.11,52.25 50.11,52.2 | 50.11,52.25 C15.1 | 61.24,22.84 61.27,22.84 61.27,24 | C10.2 70.31,54.6 70.31,54.8 71.03,55.52 72.66,55.52 73.37,54.8 73.68,54.39 75.31,52.76 75.31,51.13 R5.2 75.42,50.62 75.42,48.27 R4.2 75.42,47.76 72.25,44.6 72.25,43.68 71.94,43.27 | 73.37,41.74 J2.2 73.07,42.15 71.94,43.27 | 61.33,39.59 U17.3 | 50.41,53.58 50.41,52.66 50.11,52.25 | 50.41,53.58 51.02,54.19 66.44,54.19 68.27,52.35 U2.3 | 62.76,32.66 62.76,25.41 61.64,24.29 C8.1 | 71.94,43.27 63.88,43.27 61.33,40.72 61.33,40.11 U17.3 | v62.76,34.7 62.76,33.27 | v61.54,35.92 61.54,39.09 U17.3 | v39.24,50.16 39.29,50.21 39.29,50.82 43.88,55.41 48.47,55.41 50.01,53.88 50.41,53.58 | J2.23 66.45,9.3 64.47,9.3 62.28,9.3 | 62.28,9.3 62.13,9.14 J28.15 | R7.2 56.59,15.56 R8.2 56.27,15.24 51.51,15.24 49.53,17.22 J1.2 49.19,19.08 45.11,19.08 R6.2 | R16.2 62.28,11.14 62.28,9.3
  Top 1.27: C4.1 41.41,29.7 v42.47,30.76
  Bottom 0.203: v50.75,14.02 51,13.77 49.63,12.39 v49.63,6.55
  Bottom 1.016: v61.54,35.92 v62.76,34.7 | 42.47,43.78 43.68,43.78 43.78,43.68 44.6,43.68 JP1.5 | 42.47,31.53 43.88,31.53 45.11,30.31 45.11,22.66 48.68,19.08 48.88,19.08 49.09,18.88 49.49,18.88 J1.2
  Bottom 1.27: v42.47,30.76 42.47,31.53 42.47,39.09 | 42.47,39.09 42.47,43.78 42.47,46.94 v39.24,50.16 | v44.22,39.04 42.52,39.04 42.47,39.09
  pour Top (no thermals): 29.92,30.38 31.88,30.38 31.88,29.34 34.06,29.34 34.06,30.78 34.95,30.78 34.95,29.34 36.02,29.34 36.02,30.76 39.88,30.76 39.88,24.77 38.76,24.77 38.76,28.91 31.9,28.91 31.9,28.37 29.92,28.37
5V0  (via drill 0.6)
  Top 0.203: R17.2 56.02,11.07 v54.41,11.07 | R18.2 46.77,10.97 v45.41,10.97
  Top 1.016: 29.9,44.09 30,44.09
  Bottom 0.203: v54.41,11.07 56.44,9.04 X1.P$1 | v45.41,10.97 41.91,7.47 41.91,4.27
  Bottom 1.016: 23.22,49.61 23.14,49.53 | 23.68,7.04 23.14,7.39
  Bottom 1.27: v39.27,44.91 34.57,49.61 23.22,49.61 | 23.14,49.53 23.14,7.39 | 58.06,1.63 59.11,1.63 60.58,3.1 J28.16 | X1.P$1 58.06,8.14 58.06,1.63 | 23.68,7.04 26.45,4.27 41.91,4.27 43.41,4.27 46.05,1.63 58.06,1.63
  pour Top (no thermals): 30,45.29 31.95,45.29 31.95,44.25 34.14,44.25 34.14,45.69 35.03,45.69 35.03,44.25 36.09,44.25 36.09,45.67 39.95,45.67 39.95,39.67 38.84,39.67 38.84,43.81 31.98,43.81 31.98,43.28 30,43.28
CB0
  Top 0.203: B0.BUTTON 86.3,13.53 J2.14
CB1
  Top 0.203: B1.BUTTON 76.07,31.37 J2.8
CB2
  Top 0.203: J2.4 74.87,39.12 B2.BUTTON
ENABLE3V
  Top 0.203: 35.47,32.46 35.51,32.55 R12.1
  Top 0.381: 35.39,32.54 35.47,32.46 U7.4
ENABLE5V
  Top 0.203: R1.1 35.72,47.25 39.8,47.25 43.27,43.78 43.27,38.58 44.09,37.76 46.43,37.76 49.49,34.7 49.49,34.09 J1.14
  Top 0.381: R1.1 35.55,47.37 U6.4
FB3
  Top 0.025: U7.3 35.53,27.53
  Top 0.203: R13.1 37.55,25.31 37.61,25.31
  Top 0.381: 35.53,27.53 35.46,27.46 | 36.31,25.57 R14.2 36.31,25.38
  Top 0.406: 37.61,25.38 37.61,25.31 37.61,25.25
  Top 0.508: 35.46,27.46 35.46,26.42 36.31,25.57
  Top 1.016: 36.31,25.38 37.61,25.38
FB5
  Top 0.025: U6.3 35.6,42.44 35.61,42.44
  Top 0.381: 35.61,42.44 35.53,42.37 | 36.38,40.48 R3.2 36.39,40.29
  Top 0.406: 37.69,40.29 R2.1
  Top 0.508: 35.53,42.37 35.53,41.33 36.38,40.48
  Top 1.016: 36.39,40.29 37.69,40.29
FLASHCS
  Top 0.203: U17.1 63.88,39.49 69.7,33.68 69.7,33.57 70.62,32.66 71.33,32.66 72.05,31.94 72.05,20 70.92,18.88 J2.19
GND  (via drill 0.6)
  Top 0.203: C7.2 61.97,17.87 | v66.62,7.49 66.52,7.49 65.94,6.91 65.94,4.37 65.99,4.37 66.04,4.32 68.53,4.32 68.53,6.25 | 63.5,6.3 63.5,6.25 63.45,6.25 63.45,4.42 60.3,4.42
  Top 0.254: 64.67,3.15 63.45,3.15 63.45,4.42
  Top 0.762: 61.97,17.87 U4.4 | J28.14 65.94,4.37
  Top 1.016: 35.1,23.47 C3.2 | 54.29,52.15 U3.GND
  Bottom 0.203: 73.53,13.78 72.85,13.09 72.85,12.14
  Bottom 1.016: J2.24 73.48,13.78 73.53,13.78
  other vias: 84.2,36.63 85.88,38.28 88.09,38.07 92.28,37.97 94.41,38 83.77,54.86 87.4,55.47 92.89,55.65 95.63,54.23 84.96,18.97 89.13,19.08 93.42,19.43 97.08,18.8 85.9,1.91 95.83,2.06 98.5,6.91 82.55,34.59 35.64,13.87 46.74,36.17 46.94,39.19 81.92,22.53 97.61,42.77 99.54,47.9 99.54,51.38 99.24,23.11 99.59,26.72 99.54,32.13 97.59,35.48 99.39,12.7 99.39,9.4 83.06,41.2 82.25,13.39 47.42,41.22 44.58,36.86 59.46,27.61 81.51,28.7 8.26,8.51 20.19,11 17.86,10.59 26.47,10.74 26.11,15.06 26.26,20.42 25.88,26.11 26.06,33.68 25.73,37.95 26.11,42.75 16.23,48.84 9.6,47.8 8.15,40.61 11.58,29.92 6.88,22.63 11.76,19.46 65.99,34.19 66.04,31.95 65.61,29.39 57.58,36.27 57.84,34.29 57.28,39.04 67.23,38.99 66.73,41.55 59.87,42.9 58.04,44.48 58.98,46.41 62.74,46.18 65.38,46.18 64.34,49.43 59.23,52.55 63.45,52.5 67.31,55.73 77.44,55.27 78.03,53.09 78.74,50.37 79.12,47.65 38.76,54.05 35.48,53.75 32.49,55.47 31.72,52.86 44.78,34.09 46.53,32.66 69.98,10.39 17.91,16.46 20.09,16.66 20.17,26.9 20.57,32.38 20.62,36.63 39.78,9.19 49.02,44.2 48.49,46.81 62.51,55.83 58.06,55.88 80.37,40.46 79.98,38.84 81.48,32.61 81.51,35.92 78.77,16.31 47.96,53.06 44.63,17.25 44.7,15.16 30.45,2.01 26.97,2.49 36.75,1.85 58.85,18.72 60.63,16.94 55.24,27.97 57.38,25.17 61.24,29.18 54.08,30.51 54.13,32.38 78.82,24.94 78.82,23.32 81.51,25.5 81.51,11.79 81.51,14.33 80.16,1.3 78.54,1.35 72.77,12.12 63.68,7.9 61.19,14.25 63.22,14.2 54.58,13.28 57.12,14 59.56,9.27 59.72,7.49 59.61,5.71 76.1,1.3 73.46,1.24 62.89,1.3 42.72,2.06 51.26,4.5 52.43,6.99 66.07,11.76 66.12,14.86 67.69,23.9 67.69,25.63 78.77,19.81 75.41,23.11 75.26,27.94 75.36,26.62 81.46,17.22 48.92,14.61 47.4,16.08 68.4,8.92 76.53,12.37 76.78,10.9
  pour Bottom (isolate 0.305): 101.6,57.15 101.6,0 0,0 0,57.15
  pour Top (isolate 0.305, hatched): 81.79,57.15 101.6,57.15 101.6,0 81.79,0
  pour Top (isolate 0.305, rank 2): 81.28,57.15 0,57.15 0,0 81.28,0
  pour Top (no thermals): 34.11,39.62 34.11,43.56 38.2,43.56 38.2,41.48 36.4,41.48 36.4,43.31 35.08,43.31 35.08,39.62
  pour Top (rank 2, no thermals): 26.87,48.79 40.51,48.79 40.51,33.83 26.87,33.83
  pour Top (rank 2, no thermals): 26.8,33.88 40.44,33.88 40.44,18.92 26.8,18.92
  pour Top (no thermals): 34.04,24.71 34.04,28.65 38.13,28.65 38.13,26.57 36.32,26.57 36.32,28.4 35,28.4 35,24.71
LED0
  Top 0.203: J2.16 85.04,12.24 89.84,12.24 91.54,10.54 B0.A
LED1
  Top 0.203: J2.12 73.99,28.96 75.41,30.38 89.74,30.38 B1.A
LED2
  Top 0.203: J2.6 74.19,36.58 80.92,43.31 83.91,43.31 B2.A
LSM9DSOCSG  (via drill 0.6)
  Top 0.203: U4.19 59.06,22.99 v58.37,22.99
  Bottom 0.203: v58.37,22.99 65.1,16.26 J2.21
LSM9DSOCSXM  (via drill 0.5)
  Top 0.203: U4.20 59.81,21.74 57.28,21.74 56.59,22.43 v56.59,22.66
  Bottom 0.203: v56.59,22.66 52.73,18.8 J1.1
LSMDENG  (via drill 0.51)
  Top 0.203: v68.27,19.8 66.84,21.23 63.68,21.23 U4.10
  Bottom 0.203: v68.27,19.8 70.62,17.45 71.33,17.45 72.66,16.12 73.27,16.12 73.37,16.23 J2.22
LSMDRDYG
  Top 0.203: U4.12 63.68,22.25 68.07,22.25 69.6,23.78 70.82,23.78 J2.15
LSMINT1  (via drill 0.6)
  Top 0.203: U4.13 67.78,27.64 v69.8,27.64
  Bottom 0.203: v69.8,27.64 72.08,27.64 72.08,30.53 73.05,31.5 J2.10
LSMINT2
  Top 0.203: U4.14 62.45,22.86 62.45,23.27 70.62,31.43 70.82,31.43 J2.9
LSMINTG
  Top 0.203: U4.11 63.68,21.74 68.17,21.74 68.68,22.25 70.01,22.25 70.82,21.43 J2.17
N$1
  Bottom 1.27: 26.06,30.15 26.06,30.18
N$3
  Top 1.016: R15.1 33.06,7.96 31.33,7.96 30.21,6.84 JP3.1 29.7,6.63 12.96,6.63 10.1,3.78 BAT1.+
N$4
  Top 0.203: U4.9 63.68,20.72 65.11,20.72 66.13,19.7 C6.2
N$5
  Top 0.203: U4.7 63.68,19.7 63.68,17.86 63.98,17.55 C7.1
N$6
  Top 0.203: U4.8 63.68,20.21 64.09,20.21 66.13,18.16 66.13,17.96 C6.1
N$8
  Top 0.203: R9.2 80.49,9.72 B0.C
N$9
  Top 0.203: R10.2 89.77,26.84 B1.C
N$10
  Top 0.203: R11.2 81.03,36.92 B2.C
N$11
  Top 1.016: D4.C 36.33,7.35 36.33,5.1 36.74,4.69 S3.2
N$12
  Top 1.016: D4.A 36.23,9.7 33.17,9.7 R15.2 32.66,9.49 30.31,9.49 30.21,9.39 JP3.2
N$14
  Top 0.203: Q2.3 59.01,12.79 57.76,12.79 | 57.76,12.79 R17.1 | X1.P$3 52.22,10.11 54.51,10.11 54.56,10.16 57.51,10.16 57.76,10.41 57.76,12.79
N$19
  Top 0.203: R18.1 46.96,12.86 48.21,12.86 | 48.21,12.86 Q1.3 | X1.P$4 48.21,9.1 48.21,12.86
P0_6
  Top 0.203: JP.2 37.57,22.28 38.58,23.29 40.28,23.29 44.45,27.46 48.03,27.46 J1.10
P0_7
  Top 0.203: JP.4 38.84,22.3 39.09,22.55 40.84,22.55 44.7,26.42 J1.8
P4MISO
  Top 0.203: U4.23 59.9,20.21 59.9,20.61 U4.22 59.8,20.72 55.21,20.72 52.71,23.22 | 52.71,23.22 52.15,23.78 J1.5 | 52.71,23.22 53.47,23.98 54.39,23.98 61.94,31.53 61.94,35.1 62.56,35.72 62.56,39.49 U17.2
P4MOSI
  Top 0.203: U4.24 59.8,19.7 55.31,19.7 52.35,22.66 51.64,22.66 50.92,23.37 50.92,27.76 52.05,28.88 J1.9 52.15,28.98 55.82,28.98 59.6,32.76 60.01,32.76 U17.5
P4SPICLK  (via drill 0.51)
  Top 0.203: v53.98,23.16 55.92,21.23 59.8,21.23 U4.21 | v53.98,24.8 61.23,32.04 61.23,32.76 U17.6
  Bottom 0.203: J1.3 52.15,21.33 v53.98,23.16 v53.98,24.8
QUADA  (via drill 0.33)
  Top 0.203: Q1.2 50.91,11.01 R19.1 52.66,12.76 53.07,13.16 v53.07,13.88 | v55.52,16.33 56.33,17.14 56.54,17.14 R8.1 | v43.98,27.96 46.13,30.11 49.7,30.11 51.02,31.43 52.05,31.43 J1.11
  Bottom 0.203: v55.52,16.33 v53.07,13.88 53.07,13.98 52.56,13.98 43.98,22.55 v43.98,27.96
QUADB  (via drill 0.33)
  Top 0.203: R16.1 60.71,11.27 Q2.2 60.01,11.33 v60.01,12.25 | v53.47,20.51 54.7,19.29 56.02,19.29 57.96,17.35 58.98,17.35 R7.1
  Bottom 0.203: J1.7 52.15,26.33 53.58,26.33 54.8,25.1 54.8,22.86 53.47,21.53 v53.47,20.51 53.17,20.21 51.43,20.21 50.92,19.7 50.92,17.96 51.23,17.66 55.21,17.66 60.01,12.86 v60.01,12.25
SCL  (via drill 0.51)
  Top 0.203: 51.64,49.49 51.64,43.88 v51.43,43.68 | 51.64,49.49 51.64,51.13 U3.SCK 54.6,48.23 | 51.64,49.49 48.98,49.49 47.35,51.13 44.7,51.13 JP1.2
  Top 0.406: R4.1 71.09,48.26 70.11,49.25 U2.5 70.08,48.67 69.65,48.23 54.6,48.23
  Bottom 0.203: v51.43,43.68 49.49,41.74 J1.20
SDA  (via drill 0.51)
  Top 0.203: v54.49,49.7 55.21,50.41 55.31,50.52
  Top 0.406: R5.1 72.38,49.25 U2.6 71.3,49.25 70.03,50.52 55.31,50.52 U3.DATA
  Bottom 0.203: 51.74,46.94 45,53.68 44.7,53.68 JP1.1 | 51.74,46.94 53.27,45.41 53.27,43.06 52.15,41.94 52.15,41.74 J1.19 | 51.74,46.94 v54.49,49.7
SW3
  pour Top (no thermals): 29.9,28.19 33.83,28.19 33.83,22.1 31.37,22.1 31.37,24.38 29.9,24.38
SW5
  pour Top (no thermals): 29.97,43.1 33.91,43.1 33.91,37.01 31.45,37.01 31.45,39.29 29.97,39.29
UA0  (via drill 0.51)
  Top 0.203: v75.82,18.06 75.82,6.63 74.91,5.71 J28.5
  Bottom 0.203: v75.82,18.06 73.88,20 73.07,20 72.56,20.51 71.74,19.7 71.64,19.7 71.33,20 70.52,20 70.01,20.51 69.9,20.51 69.6,20.21 69.09,20.21 67.97,21.33 67.35,21.33 52.15,36.53 J1.15
UA1
  Bottom 0.203: J1.16 49.49,36.53 49.49,35.51 48.37,34.39 48.37,31.12 49.39,30.11 49.9,30.11 50.92,29.08 50.92,28.57 51.94,27.55 52.96,27.55 57.56,22.96 57.56,15.92 60.82,12.65 60.82,5.1 61.54,4.39 71.03,4.39 72.25,5.61 J28.7
UA2
  Bottom 0.203: J1.18 49.6,39.19 50.52,39.19 51.64,40.31 71.33,40.31 72.25,39.39 72.25,38.68 73.17,37.76 73.88,37.76 79.91,31.74 79.91,5.71 J28.1
UA3
  Bottom 0.203: J2.7 70.92,33.98 71.94,33.98 73.27,32.66 73.78,32.66 76.64,29.8 76.64,15.21 73.58,12.14 73.58,11.74 67.56,5.71 67.25,5.71 J28.11
UA4  (via drill 0.51)
  Top 0.203: v55.72,30.11 55.72,34.59 52.15,38.17 52.15,39.09 J1.17 | v67.45,13.37 v67.45,18.37
  Bottom 0.203: v67.45,18.37 v55.72,30.11 | v67.45,13.37 67.45,10 64.7,7.25 64.7,5.71 J28.13
UA6
  Top 0.203: J2.18 73.48,21.33 73.48,21.02 75.01,19.49 75.01,7.65 73.58,6.22 73.58,5.1 72.86,4.39 71.74,4.39 71.03,3.67 71.03,2.55 70.31,1.84 68.48,1.84 67.25,3.06 J28.12
UA7
  Top 0.203: J2.20 73.37,18.78 73.37,17.86 72.05,16.53 72.05,9.39 71.03,8.37 71.03,4.39 69.8,3.16 J28.10
UA8  (via drill 0.33)
  Top 0.203: v74.6,38.06 74.5,37.96 72.97,37.96 71.84,39.09 70.92,39.09 J2.3
  Bottom 0.203: v74.6,38.06 74.6,37.66 80.62,31.64 80.62,6.74 81.23,6.12 81.23,5.1 80.52,4.39 73.58,4.39 72.35,3.16 J28.8
UA9  (via drill 0.51)
  Top 0.203: v69.09,21.43 69.09,18.98 70.42,17.66 71.33,17.66 72.25,18.57 72.25,19.29 72.97,20 73.88,20 74.6,19.29 74.6,10.71 v71.84,7.96
  Bottom 0.203: v69.09,21.43 69.09,35 70.62,36.53 70.82,36.53 J2.5 | v71.84,7.96 69.8,5.92 69.8,5.71 J28.9
UA10  (via drill 0.33)
  Top 0.203: v41.23,26.23 46.43,31.43 49.49,31.43 J1.12 | v41.23,6.22 42.96,6.22 48.68,0.51 71.54,0.51 73.58,2.55 73.58,3.67 74.29,4.39 76.13,4.39 77.35,5.61 J28.3
  Bottom 0.203: v41.23,6.22 v41.23,26.23
VIN
  Top 0.127: U6.6 33.77,45.23 | U7.6 33.69,30.32
  Top 0.152: 33.55,47.35 33.67,47.35 R1.2
  Top 0.381: 33.69,30.32 33.69,32.54
  Top 0.762: 33.48,32.38 33.48,31.62 | 33.55,47.35 33.55,45.41
  Top 1.016: 33.68,32.66 R12.2 | 33.68,32.66 33.69,32.54 | 33.78,34.65 33.78,33.17 33.68,32.66 | 35.1,21.74 C3.1 35.06,19.16 JP.1 37.54,16.64 37.54,14.25 37.49,14.2 D3.C 37.71,13.91 C5.1 40.21,13.78 40.72,13.27 42.25,13.27 43.98,11.53 43.98,10.51 39.29,5.82 39.29,4.69 S3.1
  pour Top (no thermals): 33.91,44.5 32.18,44.5 32.18,45.52 29.69,45.52 29.69,38.86 30.58,38.86 30.58,36.63 34.65,36.63 34.65,37.21 35.66,37.21 35.66,34.65 28.12,34.65 28.12,46.61 33.91,46.61
  pour Top (no thermals): 33.83,29.59 32.11,29.59 32.11,30.61 29.62,30.61 29.62,23.95 30.51,23.95 30.51,21.72 34.57,21.72 34.57,22.3 35.59,22.3 35.59,19.74 28.04,19.74 28.04,31.7 33.83,31.7
XRES  (via drill 0.6)
  Top 0.203: J1.6 48.12,23.88 R6.1 44.6,20.72 42.66,20.72 JP.10 42.65,22.81 v43.13,23.29 | v42.67,11.02 35.13,11.02 S1.2
  Top 1.016: S1.2 S1.1
  Bottom 0.203: v43.13,23.29 43.13,11.48 v42.67,11.02

### Text on the board
tPlace: SDAT | SCLK | GND | 3V3 | 3V | 02 | 32 | 34 | 05 | 04 | 12 | 03 | 0V | 5V | 0V | 25 | 23 | 36
tNames: Newtons Attic / Physics Lab V1.2 / Elkhorn Creek Engineering
bNames: Physics Lab V1.2 / Elkhorn Creek Engineering